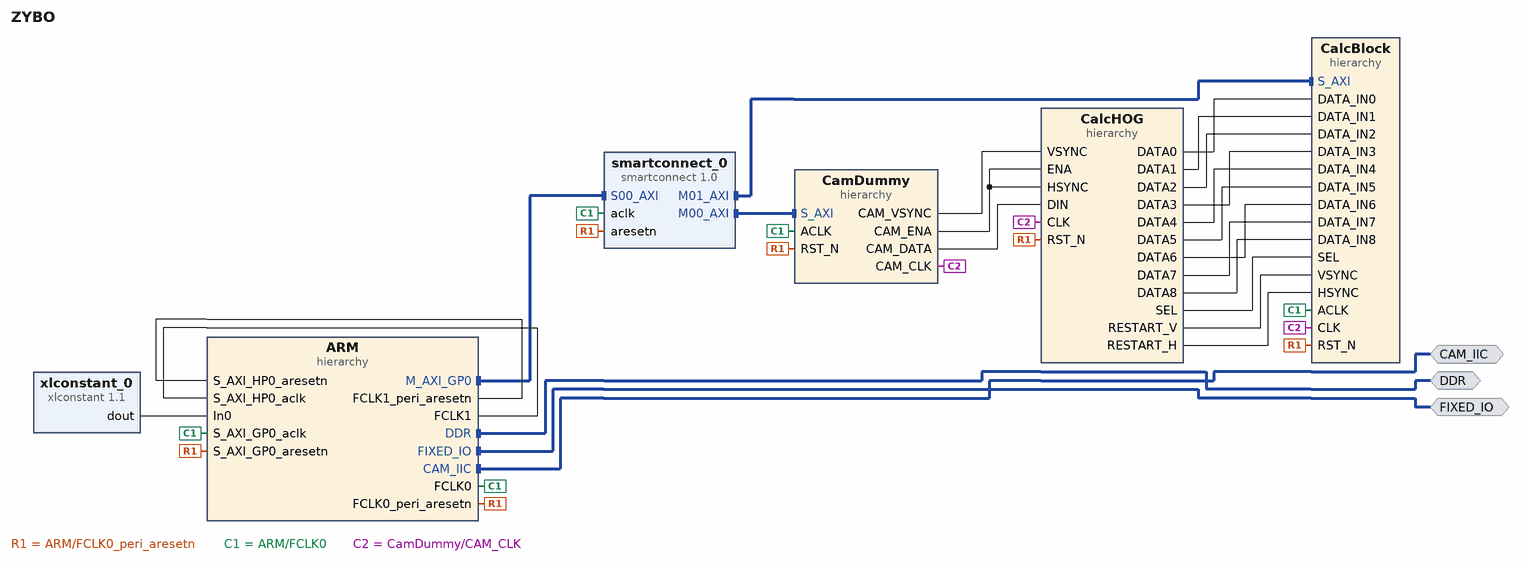
[diagram p0: block diagram of the top level]
# Vivado block design ZYBO, xc7z010clg400-1, Vivado 2016.3
create_bd_design ZYBO

create_bd_intf_port -mode Master -vlnv xilinx.com:interface:ddrx_rtl:1.0 DDR
create_bd_intf_port -mode Master -vlnv xilinx.com:display_processing_system7:fixedio_rtl:1.0 FIXED_IO
create_bd_intf_port -mode Master -vlnv xilinx.com:interface:iic_rtl:1.0 CAM_IIC

create_bd_cell -type hier ARM
create_bd_cell -type hier CalcBlock
create_bd_cell -type hier CalcHOG
create_bd_cell -type ip -vlnv xilinx.com:ip:smartconnect:1.0 smartconnect_0
set_property -dict {CONFIG.NUM_MI 2 CONFIG.NUM_SI 1 CONFIG.NUM_CLKS 1} [get_bd_cells smartconnect_0]
create_bd_cell -type hier CamDummy
create_bd_cell -type ip -vlnv xilinx.com:ip:xlconstant:1.1 xlconstant_0
set_property -dict {CONFIG.CONST_VAL 0} [get_bd_cells xlconstant_0]

# ---- hierarchy /ARM ----
current_bd_instance /ARM
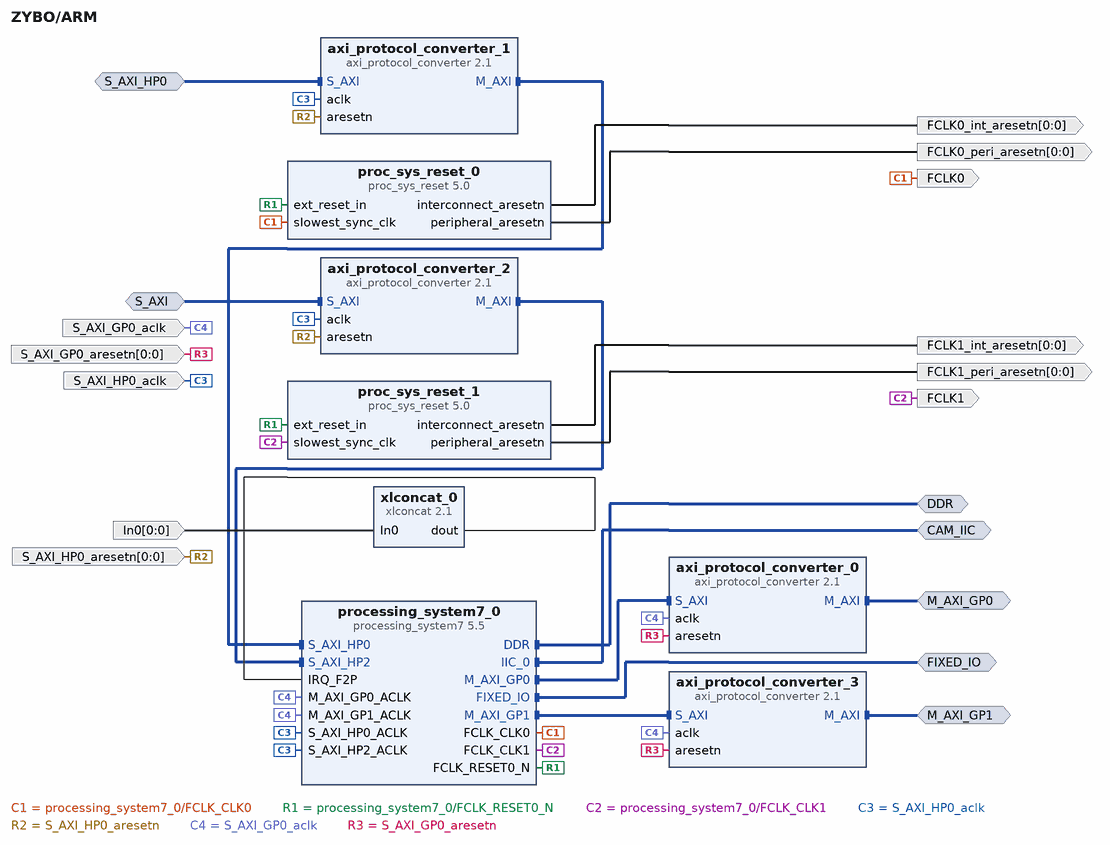
[diagram p1: block diagram inside /ARM]
create_bd_intf_pin -mode Master -vlnv xilinx.com:interface:ddrx_rtl:1.0 DDR
create_bd_intf_pin -mode Master -vlnv xilinx.com:display_processing_system7:fixedio_rtl:1.0 FIXED_IO
create_bd_intf_pin -mode Master -vlnv xilinx.com:interface:aximm_rtl:1.0 M_AXI_GP0
create_bd_intf_pin -mode Slave -vlnv xilinx.com:interface:aximm_rtl:1.0 S_AXI_HP0
create_bd_intf_pin -mode Master -vlnv xilinx.com:interface:iic_rtl:1.0 CAM_IIC
create_bd_intf_pin -mode Slave -vlnv xilinx.com:interface:aximm_rtl:1.0 S_AXI
create_bd_intf_pin -mode Master -vlnv xilinx.com:interface:aximm_rtl:1.0 M_AXI_GP1
create_bd_pin -dir O -type clk FCLK0
create_bd_pin -dir I -from 0 -to 0 In0
create_bd_pin -dir O -from 0 -to 0 -type rst FCLK0_int_aresetn
create_bd_pin -dir O -from 0 -to 0 -type rst FCLK0_peri_aresetn
create_bd_pin -dir O -type clk FCLK1
create_bd_pin -dir I -type clk S_AXI_HP0_aclk
create_bd_pin -dir I -from 0 -to 0 -type rst S_AXI_HP0_aresetn
create_bd_pin -dir I -type clk S_AXI_GP0_aclk
create_bd_pin -dir I -from 0 -to 0 -type rst S_AXI_GP0_aresetn
create_bd_pin -dir O -from 0 -to 0 -type rst FCLK1_int_aresetn
create_bd_pin -dir O -from 0 -to 0 -type rst FCLK1_peri_aresetn

create_bd_cell -type ip -vlnv xilinx.com:ip:xlconcat:2.1 xlconcat_0
set_property -dict {CONFIG.NUM_PORTS 1} [get_bd_cells xlconcat_0]
create_bd_cell -type ip -vlnv xilinx.com:ip:axi_protocol_converter:2.1 axi_protocol_converter_3
set_property -dict [list \
  CONFIG.SI_PROTOCOL AXI3 \
  CONFIG.MI_PROTOCOL AXI4LITE \
  CONFIG.TRANSLATION_MODE 2 \
] [get_bd_cells axi_protocol_converter_3]
create_bd_cell -type ip -vlnv xilinx.com:ip:axi_protocol_converter:2.1 axi_protocol_converter_0
set_property -dict [list \
  CONFIG.SI_PROTOCOL AXI3 \
  CONFIG.MI_PROTOCOL AXI4LITE \
  CONFIG.TRANSLATION_MODE 2 \
] [get_bd_cells axi_protocol_converter_0]
create_bd_cell -type ip -vlnv xilinx.com:ip:axi_protocol_converter:2.1 axi_protocol_converter_1
set_property -dict [list \
  CONFIG.SI_PROTOCOL AXI4 \
  CONFIG.MI_PROTOCOL AXI3 \
  CONFIG.TRANSLATION_MODE 2 \
  CONFIG.DATA_WIDTH 64 \
] [get_bd_cells axi_protocol_converter_1]
create_bd_cell -type ip -vlnv xilinx.com:ip:axi_protocol_converter:2.1 axi_protocol_converter_2
set_property -dict [list \
  CONFIG.SI_PROTOCOL AXI4 \
  CONFIG.MI_PROTOCOL AXI3 \
  CONFIG.TRANSLATION_MODE 2 \
  CONFIG.DATA_WIDTH 64 \
] [get_bd_cells axi_protocol_converter_2]
create_bd_cell -type ip -vlnv xilinx.com:ip:proc_sys_reset:5.0 proc_sys_reset_0
create_bd_cell -type ip -vlnv xilinx.com:ip:proc_sys_reset:5.0 proc_sys_reset_1
create_bd_cell -type ip -vlnv xilinx.com:ip:processing_system7:5.5 processing_system7_0
set_property -dict [list \
  CONFIG.PCW_FPGA0_PERIPHERAL_FREQMHZ 100 \
  CONFIG.PCW_FPGA1_PERIPHERAL_FREQMHZ 100 \
  CONFIG.PCW_USE_M_AXI_GP1 1 \
  CONFIG.PCW_USE_S_AXI_HP0 1 \
  CONFIG.PCW_USE_S_AXI_HP2 1 \
  CONFIG.PCW_USE_FABRIC_INTERRUPT 1 \
  CONFIG.PCW_EN_CLK1_PORT 1 \
  CONFIG.PCW_IRQ_F2P_INTR 1 \
  CONFIG.PCW_IMPORT_BOARD_PRESET /home/hidemi/workspace/ZYBO/ZYBO_zynq_def.xml \
  CONFIG.PCW_QSPI_GRP_SINGLE_SS_ENABLE 1 \
  CONFIG.PCW_SD0_GRP_WP_ENABLE 0 \
  CONFIG.PCW_USB0_RESET_ENABLE 1 \
  CONFIG.PCW_USB0_RESET_IO {MIO 46} \
  CONFIG.PCW_I2C0_PERIPHERAL_ENABLE 1 \
  CONFIG.PCW_GPIO_MIO_GPIO_ENABLE 1 \
  CONFIG.PCW_GPIO_MIO_GPIO_IO MIO \
  CONFIG.PCW_UIPARAM_GENERATE_SUMMARY NONE \
] [get_bd_cells processing_system7_0]
# 2 more settings of processing_system7_0 are not shown: defaults, MIO pin electricals, DDR timing, and values the tool derives

# ---- hierarchy /CalcBlock ----
current_bd_instance /CalcBlock
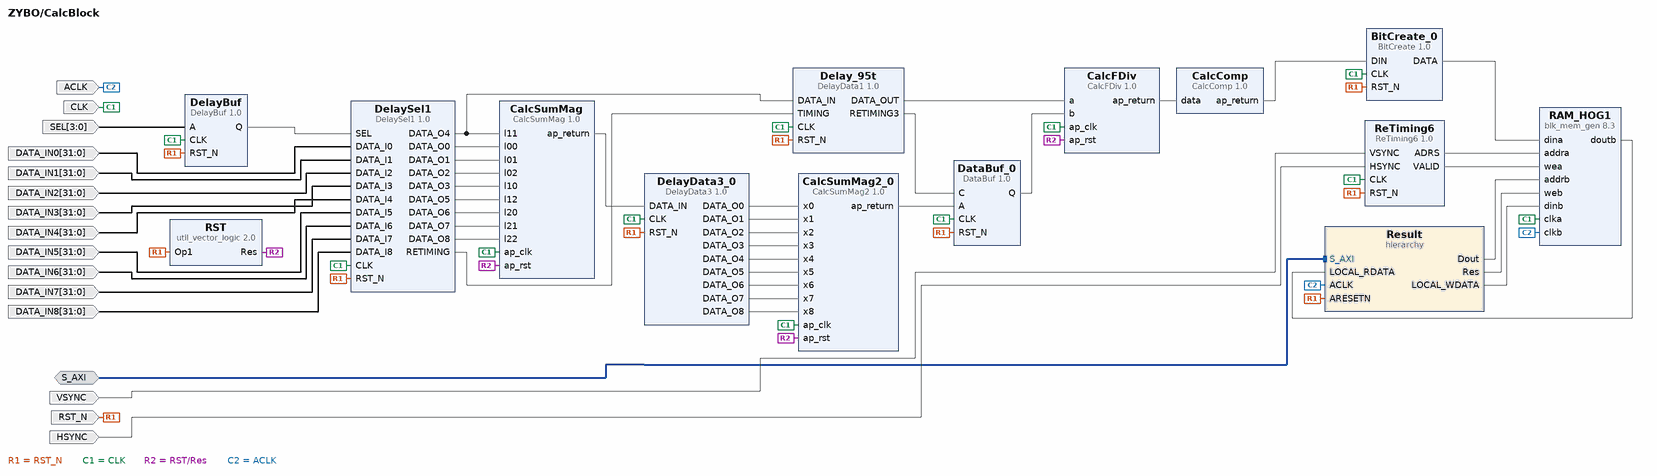
[diagram p2: block diagram inside /CalcBlock]
create_bd_intf_pin -mode Slave -vlnv xilinx.com:interface:aximm_rtl:1.0 S_AXI
create_bd_pin -dir I -type clk CLK
create_bd_pin -dir I -from 31 -to 0 DATA_IN0
create_bd_pin -dir I -from 31 -to 0 DATA_IN1
create_bd_pin -dir I -from 31 -to 0 DATA_IN2
create_bd_pin -dir I -from 31 -to 0 DATA_IN3
create_bd_pin -dir I -from 31 -to 0 DATA_IN4
create_bd_pin -dir I -from 31 -to 0 DATA_IN5
create_bd_pin -dir I -from 31 -to 0 DATA_IN6
create_bd_pin -dir I -from 31 -to 0 DATA_IN7
create_bd_pin -dir I -from 31 -to 0 DATA_IN8
create_bd_pin -dir I -from 3 -to 0 SEL
create_bd_pin -dir I VSYNC
create_bd_pin -dir I HSYNC
create_bd_pin -dir I -type clk ACLK
create_bd_pin -dir I RST_N

create_bd_cell -type ip -vlnv xilinx.com:ip:util_vector_logic:2.0 RST
set_property -dict {CONFIG.C_SIZE 1 CONFIG.C_OPERATION not} [get_bd_cells RST]
create_bd_cell -type hier Result
create_bd_cell -type ip -vlnv xilinx.com:ip:blk_mem_gen:8.3 RAM_HOG1
set_property -dict [list \
  CONFIG.Memory_Type True_Dual_Port_RAM \
  CONFIG.Enable_32bit_Address false \
  CONFIG.Use_Byte_Write_Enable false \
  CONFIG.Write_Width_A 9 \
  CONFIG.Read_Width_A 9 \
  CONFIG.Enable_A Always_Enabled \
  CONFIG.Write_Width_B 9 \
  CONFIG.Read_Width_B 9 \
  CONFIG.Enable_B Always_Enabled \
  CONFIG.Register_PortA_Output_of_Memory_Primitives false \
  CONFIG.Register_PortB_Output_of_Memory_Primitives false \
  CONFIG.Use_RSTA_Pin false \
  CONFIG.Port_B_Clock 100 \
  CONFIG.Port_B_Write_Rate 50 \
  CONFIG.Port_B_Enable_Rate 100 \
  CONFIG.use_bram_block Stand_Alone \
] [get_bd_cells RAM_HOG1]
create_bd_cell -type ip -vlnv user.org:user:CalcFDiv:1.0 CalcFDiv
create_bd_cell -type ip -vlnv user.org:user:DelayBuf:1.0 DelayBuf
create_bd_cell -type ip -vlnv user.org:user:BitCreate:1.0 BitCreate_0
create_bd_cell -type ip -vlnv user.org:user:CalcComp:1.0 CalcComp
create_bd_cell -type ip -vlnv user.org:user:ReTiming6:1.0 ReTiming6
create_bd_cell -type ip -vlnv user.org:user:CalcSumMag2:1.0 CalcSumMag2_0
create_bd_cell -type ip -vlnv user.org:user:DataBuf:1.0 DataBuf_0
create_bd_cell -type ip -vlnv user.org:user:CalcSumMag:1.0 CalcSumMag
create_bd_cell -type ip -vlnv user.org:user:DelaySel1:1.0 DelaySel1
create_bd_cell -type ip -vlnv user.org:user:DelayData3:1.0 DelayData3_0
create_bd_cell -type ip -vlnv user.org:user:DelayData1:1.0 Delay_95t

# ---- hierarchy /CalcBlock/Result ----
current_bd_instance /CalcBlock/Result
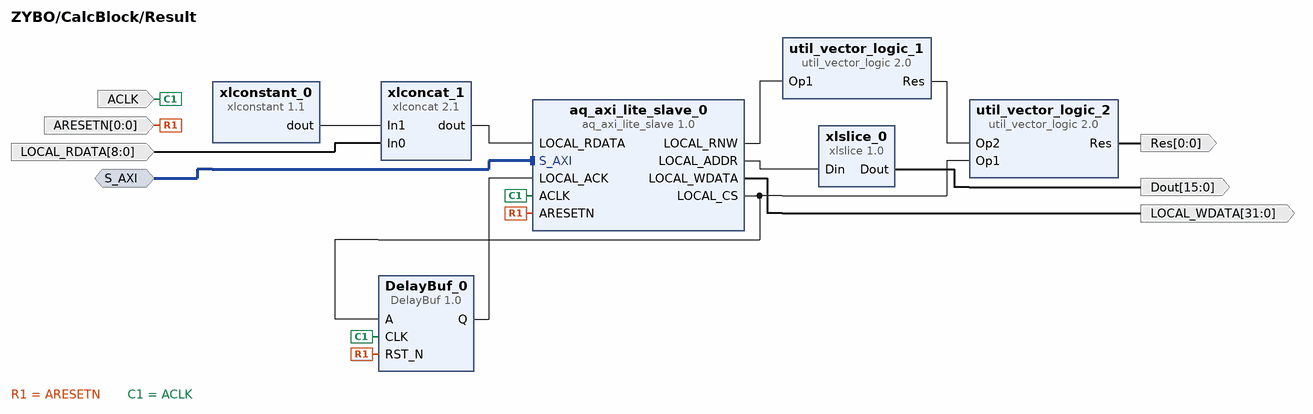
[diagram p3: block diagram inside /CalcBlock/Result]
create_bd_intf_pin -mode Slave -vlnv xilinx.com:interface:aximm_rtl:1.0 S_AXI
create_bd_pin -dir I -from 0 -to 0 -type rst ARESETN
create_bd_pin -dir I -type clk ACLK
create_bd_pin -dir O -from 15 -to 0 Dout
create_bd_pin -dir O -from 0 -to 0 Res
create_bd_pin -dir O -from 31 -to 0 LOCAL_WDATA
create_bd_pin -dir I -from 8 -to 0 LOCAL_RDATA

create_bd_cell -type ip -vlnv xilinx.com:ip:xlslice:1.0 xlslice_0
set_property -dict {CONFIG.DOUT_WIDTH 16 CONFIG.DIN_TO 2 CONFIG.DIN_FROM 17} [get_bd_cells xlslice_0]
create_bd_cell -type ip -vlnv xilinx.com:ip:util_vector_logic:2.0 util_vector_logic_1
set_property -dict {CONFIG.C_SIZE 1 CONFIG.C_OPERATION not} [get_bd_cells util_vector_logic_1]
create_bd_cell -type ip -vlnv xilinx.com:ip:util_vector_logic:2.0 util_vector_logic_2
set_property -dict {CONFIG.C_SIZE 1} [get_bd_cells util_vector_logic_2]
create_bd_cell -type ip -vlnv user.org:user:aq_axi_lite_slave:1.0 aq_axi_lite_slave_0
create_bd_cell -type ip -vlnv user.org:user:DelayBuf:1.0 DelayBuf_0
create_bd_cell -type ip -vlnv xilinx.com:ip:xlconstant:1.1 xlconstant_0
set_property -dict {CONFIG.CONST_WIDTH 23 CONFIG.CONST_VAL 0} [get_bd_cells xlconstant_0]
create_bd_cell -type ip -vlnv xilinx.com:ip:xlconcat:2.1 xlconcat_1
set_property -dict {CONFIG.IN0_WIDTH 9 CONFIG.IN1_WIDTH 23} [get_bd_cells xlconcat_1]

# ---- hierarchy /CalcHOG ----
current_bd_instance /CalcHOG
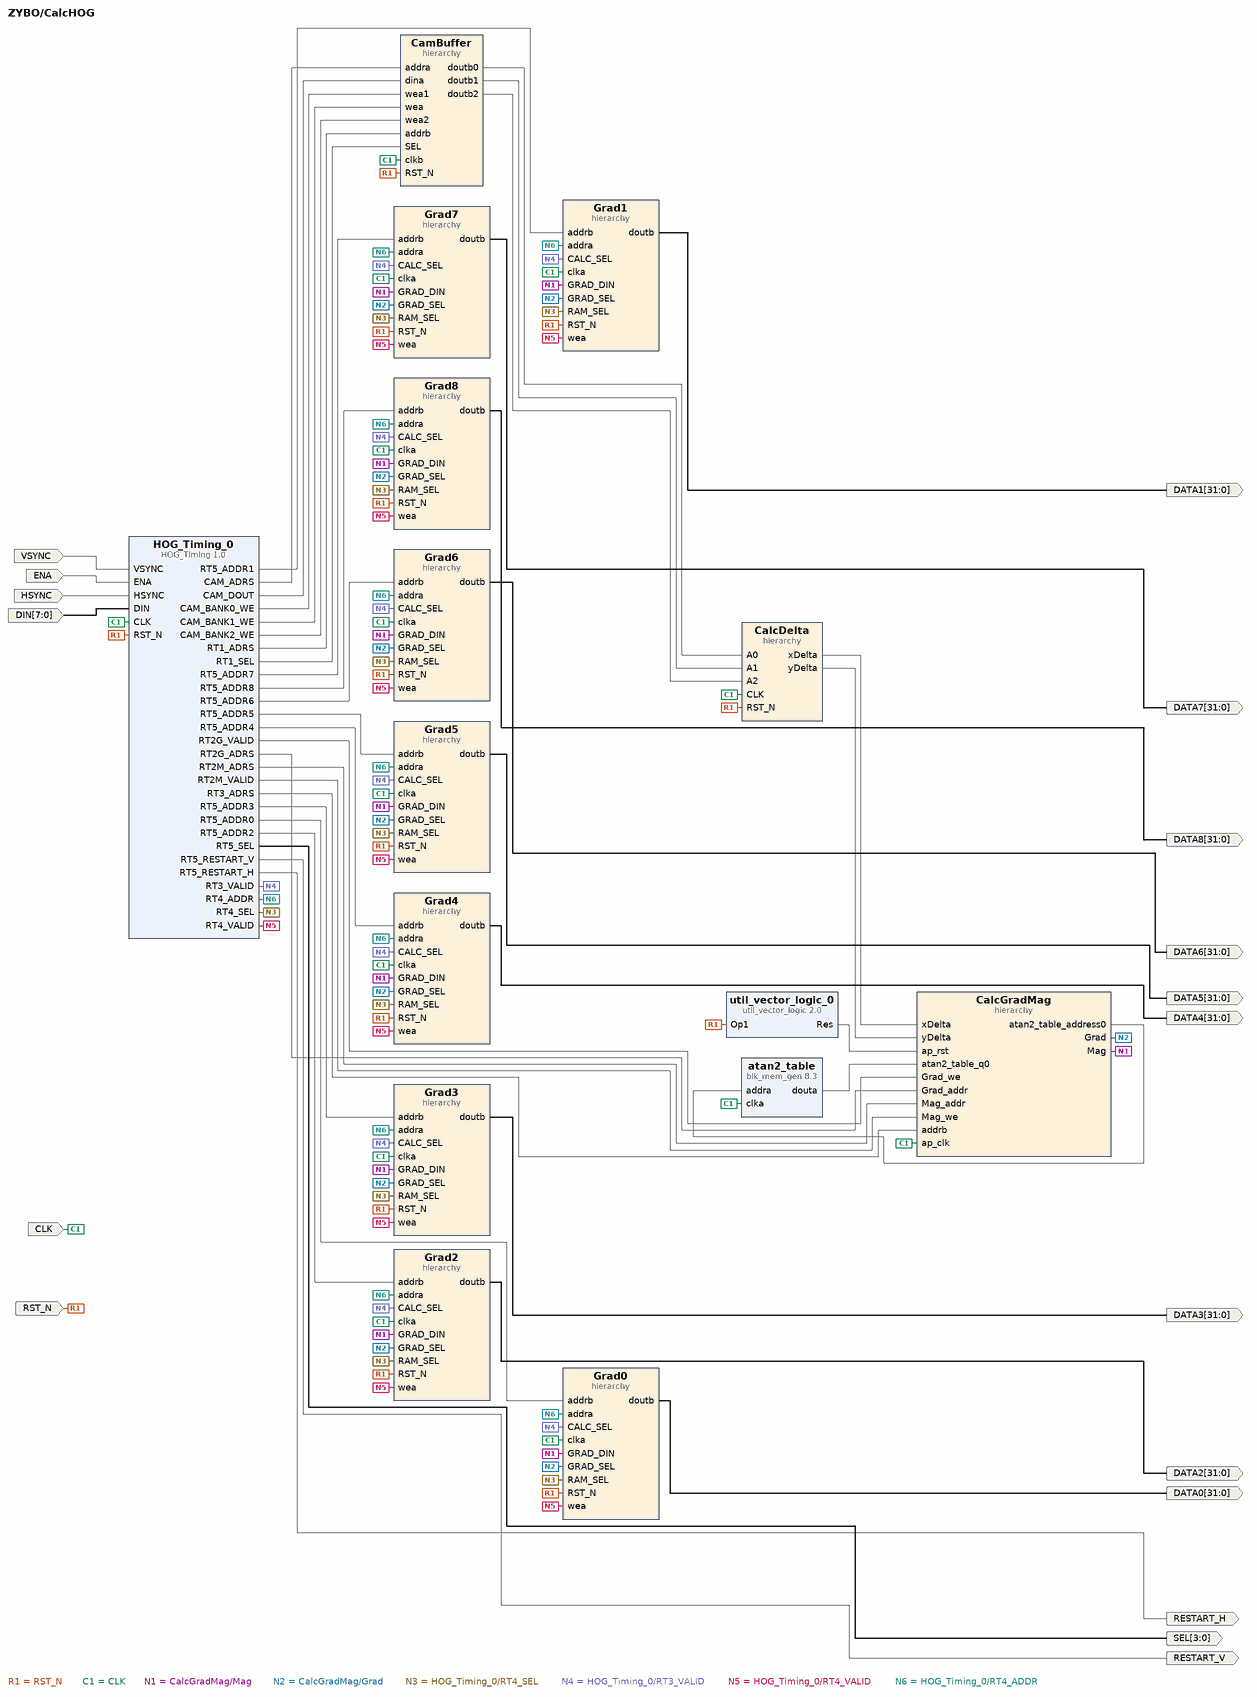
[diagram p4: block diagram inside /CalcHOG]
create_bd_pin -dir I -type clk CLK
create_bd_pin -dir I VSYNC
create_bd_pin -dir I ENA
create_bd_pin -dir I HSYNC
create_bd_pin -dir O -from 31 -to 0 DATA0
create_bd_pin -dir O -from 31 -to 0 DATA1
create_bd_pin -dir O -from 31 -to 0 DATA2
create_bd_pin -dir O -from 31 -to 0 DATA3
create_bd_pin -dir O -from 31 -to 0 DATA4
create_bd_pin -dir O -from 31 -to 0 DATA5
create_bd_pin -dir O -from 31 -to 0 DATA6
create_bd_pin -dir O -from 31 -to 0 DATA7
create_bd_pin -dir O -from 31 -to 0 DATA8
create_bd_pin -dir O -from 3 -to 0 SEL
create_bd_pin -dir I -from 7 -to 0 DIN
create_bd_pin -dir O RESTART_V
create_bd_pin -dir O RESTART_H
create_bd_pin -dir I RST_N

create_bd_cell -type ip -vlnv xilinx.com:ip:util_vector_logic:2.0 util_vector_logic_0
set_property -dict {CONFIG.C_SIZE 1 CONFIG.C_OPERATION not} [get_bd_cells util_vector_logic_0]
create_bd_cell -type ip -vlnv xilinx.com:ip:blk_mem_gen:8.3 atan2_table
set_property -dict [list \
  CONFIG.Memory_Type Single_Port_RAM \
  CONFIG.Enable_32bit_Address false \
  CONFIG.Use_Byte_Write_Enable false \
  CONFIG.Write_Width_A 4 \
  CONFIG.Read_Width_A 4 \
  CONFIG.Enable_A Always_Enabled \
  CONFIG.Register_PortA_Output_of_Memory_Primitives false \
  CONFIG.Load_Init_File true \
  CONFIG.Coe_File ../../../../../../../COE/atan2_table.coe \
  CONFIG.Use_RSTA_Pin false \
  CONFIG.Port_B_Clock 0 \
  CONFIG.Port_B_Write_Rate 0 \
  CONFIG.Port_B_Enable_Rate 0 \
  CONFIG.use_bram_block Stand_Alone \
] [get_bd_cells atan2_table]
create_bd_cell -type hier CamBuffer
create_bd_cell -type hier CalcDelta
create_bd_cell -type hier CalcGradMag
create_bd_cell -type hier Grad0
create_bd_cell -type hier Grad1
create_bd_cell -type hier Grad2
create_bd_cell -type hier Grad3
create_bd_cell -type hier Grad4
create_bd_cell -type hier Grad5
create_bd_cell -type hier Grad6
create_bd_cell -type hier Grad7
create_bd_cell -type hier Grad8
create_bd_cell -type ip -vlnv user.org:user:HOG_Timing:1.0 HOG_Timing_0

# ---- hierarchy /CalcHOG/CamBuffer ----
current_bd_instance /CalcHOG/CamBuffer
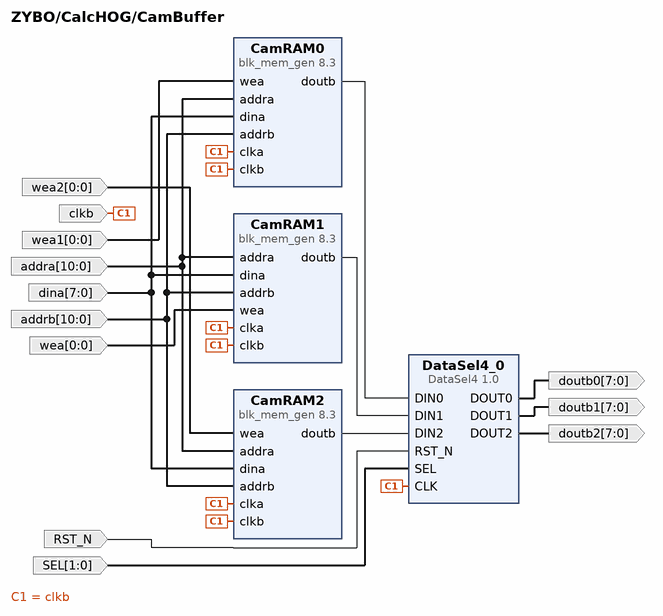
[diagram p5: block diagram inside /CalcHOG/CamBuffer]
create_bd_pin -dir I -type clk clkb
create_bd_pin -dir I -from 0 -to 0 wea
create_bd_pin -dir I -from 10 -to 0 addra
create_bd_pin -dir I -from 7 -to 0 dina
create_bd_pin -dir I -from 10 -to 0 addrb
create_bd_pin -dir O -from 7 -to 0 doutb1
create_bd_pin -dir I -from 0 -to 0 wea1
create_bd_pin -dir O -from 7 -to 0 doutb0
create_bd_pin -dir I -from 0 -to 0 wea2
create_bd_pin -dir O -from 7 -to 0 doutb2
create_bd_pin -dir I -type rst RST_N
create_bd_pin -dir I -from 1 -to 0 SEL

create_bd_cell -type ip -vlnv xilinx.com:ip:blk_mem_gen:8.3 CamRAM1
set_property -dict [list \
  CONFIG.Memory_Type True_Dual_Port_RAM \
  CONFIG.Enable_32bit_Address false \
  CONFIG.Use_Byte_Write_Enable false \
  CONFIG.Assume_Synchronous_Clk false \
  CONFIG.Write_Width_A 8 \
  CONFIG.Read_Width_A 8 \
  CONFIG.Enable_A Always_Enabled \
  CONFIG.Write_Width_B 8 \
  CONFIG.Read_Width_B 8 \
  CONFIG.Enable_B Always_Enabled \
  CONFIG.Register_PortA_Output_of_Memory_Primitives false \
  CONFIG.Register_PortB_Output_of_Memory_Primitives false \
  CONFIG.Use_RSTA_Pin false \
  CONFIG.Use_RSTB_Pin false \
  CONFIG.Port_B_Clock 100 \
  CONFIG.Port_B_Write_Rate 50 \
  CONFIG.Port_B_Enable_Rate 100 \
  CONFIG.Collision_Warnings NONE \
  CONFIG.Disable_Collision_Warnings true \
  CONFIG.Disable_Out_of_Range_Warnings true \
  CONFIG.use_bram_block Stand_Alone \
] [get_bd_cells CamRAM1]
create_bd_cell -type ip -vlnv xilinx.com:ip:blk_mem_gen:8.3 CamRAM0
set_property -dict [list \
  CONFIG.Memory_Type True_Dual_Port_RAM \
  CONFIG.Enable_32bit_Address false \
  CONFIG.Use_Byte_Write_Enable false \
  CONFIG.Assume_Synchronous_Clk false \
  CONFIG.Write_Width_A 8 \
  CONFIG.Read_Width_A 8 \
  CONFIG.Enable_A Always_Enabled \
  CONFIG.Write_Width_B 8 \
  CONFIG.Read_Width_B 8 \
  CONFIG.Enable_B Always_Enabled \
  CONFIG.Register_PortA_Output_of_Memory_Primitives false \
  CONFIG.Register_PortB_Output_of_Memory_Primitives false \
  CONFIG.Use_RSTA_Pin false \
  CONFIG.Use_RSTB_Pin false \
  CONFIG.Port_B_Clock 100 \
  CONFIG.Port_B_Write_Rate 50 \
  CONFIG.Port_B_Enable_Rate 100 \
  CONFIG.Collision_Warnings NONE \
  CONFIG.Disable_Collision_Warnings true \
  CONFIG.Disable_Out_of_Range_Warnings true \
  CONFIG.use_bram_block Stand_Alone \
] [get_bd_cells CamRAM0]
create_bd_cell -type ip -vlnv xilinx.com:ip:blk_mem_gen:8.3 CamRAM2
set_property -dict [list \
  CONFIG.Memory_Type True_Dual_Port_RAM \
  CONFIG.Enable_32bit_Address false \
  CONFIG.Use_Byte_Write_Enable false \
  CONFIG.Assume_Synchronous_Clk false \
  CONFIG.Write_Width_A 8 \
  CONFIG.Read_Width_A 8 \
  CONFIG.Enable_A Always_Enabled \
  CONFIG.Write_Width_B 8 \
  CONFIG.Read_Width_B 8 \
  CONFIG.Enable_B Always_Enabled \
  CONFIG.Register_PortA_Output_of_Memory_Primitives false \
  CONFIG.Register_PortB_Output_of_Memory_Primitives false \
  CONFIG.Use_RSTA_Pin false \
  CONFIG.Use_RSTB_Pin false \
  CONFIG.Port_B_Clock 100 \
  CONFIG.Port_B_Write_Rate 50 \
  CONFIG.Port_B_Enable_Rate 100 \
  CONFIG.Collision_Warnings NONE \
  CONFIG.Disable_Collision_Warnings true \
  CONFIG.Disable_Out_of_Range_Warnings true \
  CONFIG.use_bram_block Stand_Alone \
] [get_bd_cells CamRAM2]
create_bd_cell -type ip -vlnv user.org:user:DataSel4:1.0 DataSel4_0

# ---- hierarchy /CalcHOG/CalcDelta ----
current_bd_instance /CalcHOG/CalcDelta
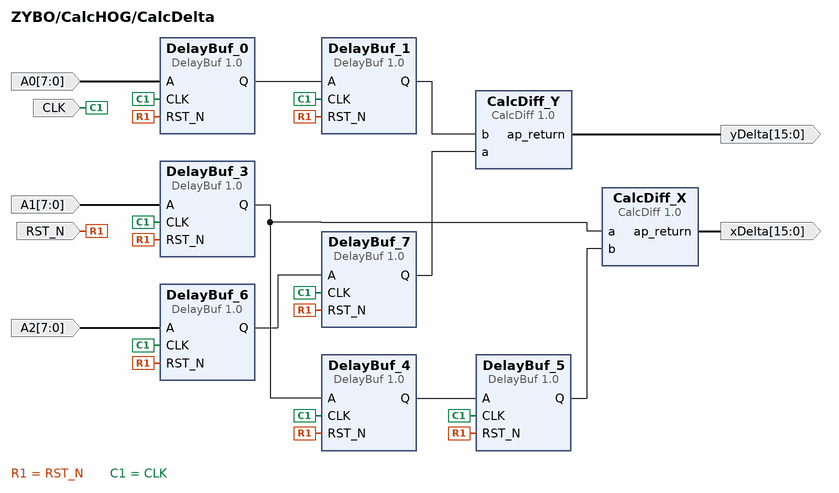
[diagram p6: block diagram inside /CalcHOG/CalcDelta]
create_bd_pin -dir I RST_N
create_bd_pin -dir I -type clk CLK
create_bd_pin -dir I -from 7 -to 0 A0
create_bd_pin -dir I -from 7 -to 0 A1
create_bd_pin -dir O -from 15 -to 0 yDelta
create_bd_pin -dir I -from 7 -to 0 A2
create_bd_pin -dir O -from 15 -to 0 xDelta

create_bd_cell -type ip -vlnv user.org:user:CalcDiff:1.0 CalcDiff_X
create_bd_cell -type ip -vlnv user.org:user:CalcDiff:1.0 CalcDiff_Y
create_bd_cell -type ip -vlnv user.org:user:DelayBuf:1.0 DelayBuf_0
create_bd_cell -type ip -vlnv user.org:user:DelayBuf:1.0 DelayBuf_3
create_bd_cell -type ip -vlnv user.org:user:DelayBuf:1.0 DelayBuf_6
create_bd_cell -type ip -vlnv user.org:user:DelayBuf:1.0 DelayBuf_1
create_bd_cell -type ip -vlnv user.org:user:DelayBuf:1.0 DelayBuf_4
create_bd_cell -type ip -vlnv user.org:user:DelayBuf:1.0 DelayBuf_7
create_bd_cell -type ip -vlnv user.org:user:DelayBuf:1.0 DelayBuf_5

# ---- hierarchy /CalcHOG/CalcGradMag ----
current_bd_instance /CalcHOG/CalcGradMag
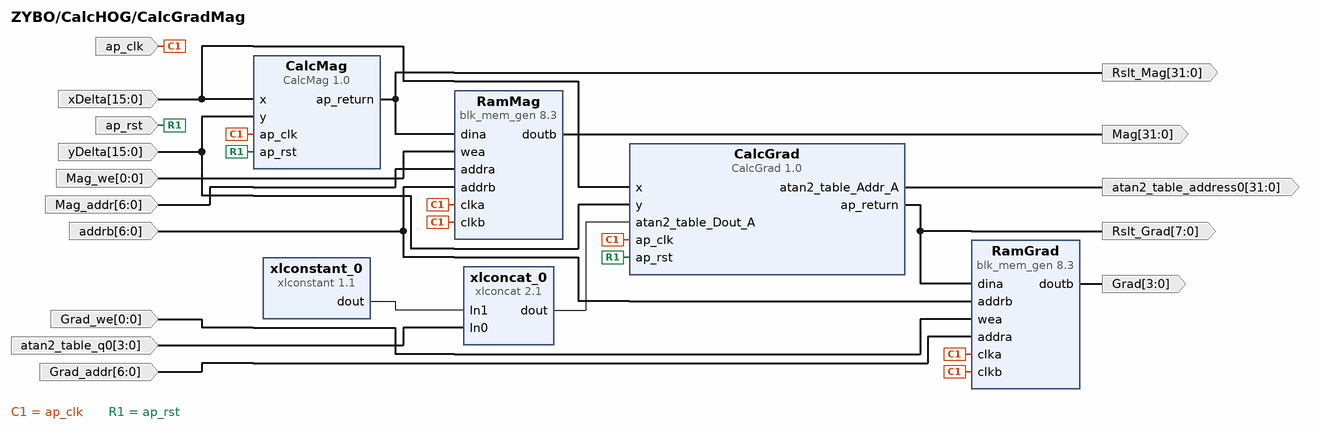
[diagram p7: block diagram inside /CalcHOG/CalcGradMag]
create_bd_pin -dir I -type clk ap_clk
create_bd_pin -dir O -from 31 -to 0 atan2_table_address0
create_bd_pin -dir I -from 3 -to 0 atan2_table_q0
create_bd_pin -dir I -from 15 -to 0 xDelta
create_bd_pin -dir I -from 15 -to 0 yDelta
create_bd_pin -dir I -from 0 -to 0 Grad_we
create_bd_pin -dir I -from 6 -to 0 Grad_addr
create_bd_pin -dir I -from 6 -to 0 addrb
create_bd_pin -dir O -from 3 -to 0 Grad
create_bd_pin -dir I -from 0 -to 0 Mag_we
create_bd_pin -dir I -from 6 -to 0 Mag_addr
create_bd_pin -dir O -from 31 -to 0 Mag
create_bd_pin -dir O -from 31 -to 0 Rslt_Mag
create_bd_pin -dir O -from 7 -to 0 Rslt_Grad
create_bd_pin -dir I ap_rst

create_bd_cell -type ip -vlnv xilinx.com:ip:blk_mem_gen:8.3 RamGrad
set_property -dict [list \
  CONFIG.Memory_Type True_Dual_Port_RAM \
  CONFIG.Enable_32bit_Address false \
  CONFIG.Use_Byte_Write_Enable false \
  CONFIG.Write_Width_A 4 \
  CONFIG.Read_Width_A 4 \
  CONFIG.Enable_A Always_Enabled \
  CONFIG.Write_Width_B 4 \
  CONFIG.Read_Width_B 4 \
  CONFIG.Enable_B Always_Enabled \
  CONFIG.Register_PortA_Output_of_Memory_Primitives false \
  CONFIG.Register_PortB_Output_of_Memory_Primitives false \
  CONFIG.Use_RSTA_Pin false \
  CONFIG.Port_B_Clock 100 \
  CONFIG.Port_B_Write_Rate 50 \
  CONFIG.Port_B_Enable_Rate 100 \
  CONFIG.Collision_Warnings NONE \
  CONFIG.Disable_Collision_Warnings true \
  CONFIG.Disable_Out_of_Range_Warnings true \
  CONFIG.use_bram_block Stand_Alone \
] [get_bd_cells RamGrad]
create_bd_cell -type ip -vlnv xilinx.com:ip:blk_mem_gen:8.3 RamMag
set_property -dict [list \
  CONFIG.Memory_Type True_Dual_Port_RAM \
  CONFIG.Enable_32bit_Address false \
  CONFIG.Use_Byte_Write_Enable false \
  CONFIG.Write_Width_A 32 \
  CONFIG.Read_Width_A 32 \
  CONFIG.Enable_A Always_Enabled \
  CONFIG.Write_Width_B 32 \
  CONFIG.Read_Width_B 32 \
  CONFIG.Enable_B Always_Enabled \
  CONFIG.Register_PortA_Output_of_Memory_Primitives false \
  CONFIG.Register_PortB_Output_of_Memory_Primitives false \
  CONFIG.Use_RSTA_Pin false \
  CONFIG.Port_B_Clock 100 \
  CONFIG.Port_B_Write_Rate 50 \
  CONFIG.Port_B_Enable_Rate 100 \
  CONFIG.Collision_Warnings NONE \
  CONFIG.Disable_Collision_Warnings true \
  CONFIG.Disable_Out_of_Range_Warnings true \
  CONFIG.use_bram_block Stand_Alone \
] [get_bd_cells RamMag]
create_bd_cell -type ip -vlnv user.org:user:CalcGrad:1.0 CalcGrad
create_bd_cell -type ip -vlnv user.org:user:CalcMag:1.0 CalcMag
create_bd_cell -type ip -vlnv xilinx.com:ip:xlconcat:2.1 xlconcat_0
set_property -dict {CONFIG.IN0_WIDTH 4 CONFIG.IN1_WIDTH 4} [get_bd_cells xlconcat_0]
create_bd_cell -type ip -vlnv xilinx.com:ip:xlconstant:1.1 xlconstant_0
set_property -dict {CONFIG.CONST_WIDTH 4 CONFIG.CONST_VAL 0} [get_bd_cells xlconstant_0]

# ---- hierarchy /CalcHOG/Grad0 ----
current_bd_instance /CalcHOG/Grad0
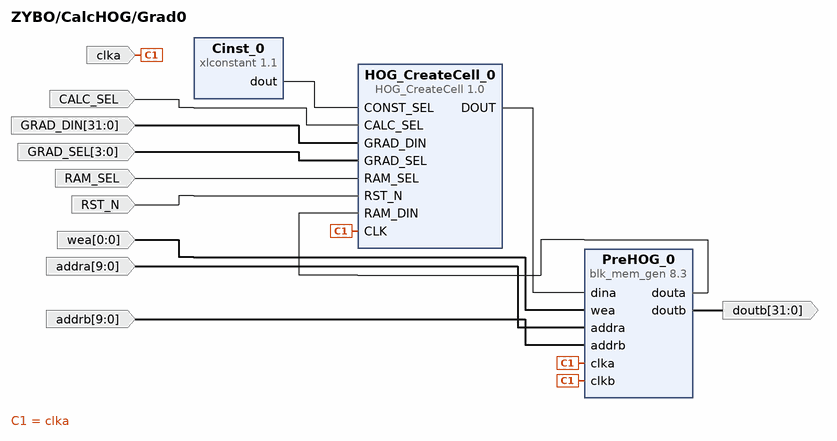
[diagram p8: block diagram inside /CalcHOG/Grad0]
create_bd_pin -dir I CALC_SEL
create_bd_pin -dir I -type clk clka
create_bd_pin -dir I -from 31 -to 0 GRAD_DIN
create_bd_pin -dir I -from 3 -to 0 GRAD_SEL
create_bd_pin -dir I RAM_SEL
create_bd_pin -dir I -from 0 -to 0 wea
create_bd_pin -dir I -from 9 -to 0 addra
create_bd_pin -dir I -from 9 -to 0 addrb
create_bd_pin -dir O -from 31 -to 0 doutb
create_bd_pin -dir I -type rst RST_N

create_bd_cell -type ip -vlnv xilinx.com:ip:xlconstant:1.1 Cinst_0
set_property -dict {CONFIG.CONST_WIDTH 4 CONFIG.CONST_VAL 0} [get_bd_cells Cinst_0]
create_bd_cell -type ip -vlnv xilinx.com:ip:blk_mem_gen:8.3 PreHOG_0
set_property -dict [list \
  CONFIG.Memory_Type True_Dual_Port_RAM \
  CONFIG.Enable_32bit_Address false \
  CONFIG.Use_Byte_Write_Enable false \
  CONFIG.Write_Width_A 32 \
  CONFIG.Read_Width_A 32 \
  CONFIG.Enable_A Always_Enabled \
  CONFIG.Write_Width_B 32 \
  CONFIG.Read_Width_B 32 \
  CONFIG.Enable_B Always_Enabled \
  CONFIG.Register_PortA_Output_of_Memory_Primitives false \
  CONFIG.Register_PortB_Output_of_Memory_Primitives false \
  CONFIG.Use_RSTA_Pin false \
  CONFIG.Port_B_Clock 100 \
  CONFIG.Port_B_Write_Rate 50 \
  CONFIG.Port_B_Enable_Rate 100 \
  CONFIG.use_bram_block Stand_Alone \
] [get_bd_cells PreHOG_0]
create_bd_cell -type ip -vlnv user.org:user:HOG_CreateCell:1.0 HOG_CreateCell_0

# ---- hierarchy /CalcHOG/Grad1 ----
current_bd_instance /CalcHOG/Grad1
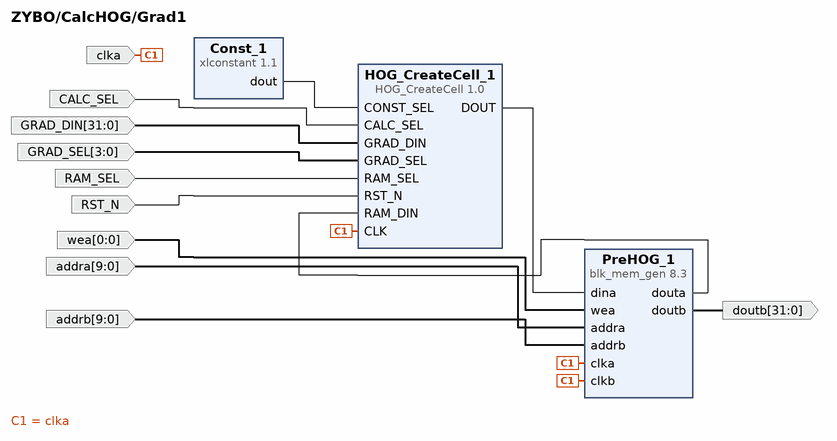
[diagram p9: block diagram inside /CalcHOG/Grad1]
create_bd_pin -dir I CALC_SEL
create_bd_pin -dir I -type clk clka
create_bd_pin -dir I -from 31 -to 0 GRAD_DIN
create_bd_pin -dir I -from 3 -to 0 GRAD_SEL
create_bd_pin -dir I RAM_SEL
create_bd_pin -dir I -from 0 -to 0 wea
create_bd_pin -dir I -from 9 -to 0 addra
create_bd_pin -dir I -from 9 -to 0 addrb
create_bd_pin -dir O -from 31 -to 0 doutb
create_bd_pin -dir I -type rst RST_N

create_bd_cell -type ip -vlnv xilinx.com:ip:xlconstant:1.1 Const_1
set_property -dict {CONFIG.CONST_WIDTH 4 CONFIG.CONST_VAL 1} [get_bd_cells Const_1]
create_bd_cell -type ip -vlnv xilinx.com:ip:blk_mem_gen:8.3 PreHOG_1
set_property -dict [list \
  CONFIG.Memory_Type True_Dual_Port_RAM \
  CONFIG.Enable_32bit_Address false \
  CONFIG.Use_Byte_Write_Enable false \
  CONFIG.Write_Width_A 32 \
  CONFIG.Read_Width_A 32 \
  CONFIG.Enable_A Always_Enabled \
  CONFIG.Write_Width_B 32 \
  CONFIG.Read_Width_B 32 \
  CONFIG.Enable_B Always_Enabled \
  CONFIG.Register_PortA_Output_of_Memory_Primitives false \
  CONFIG.Register_PortB_Output_of_Memory_Primitives false \
  CONFIG.Use_RSTA_Pin false \
  CONFIG.Port_B_Clock 100 \
  CONFIG.Port_B_Write_Rate 50 \
  CONFIG.Port_B_Enable_Rate 100 \
  CONFIG.use_bram_block Stand_Alone \
] [get_bd_cells PreHOG_1]
create_bd_cell -type ip -vlnv user.org:user:HOG_CreateCell:1.0 HOG_CreateCell_1

# ---- hierarchy /CalcHOG/Grad2 ----
current_bd_instance /CalcHOG/Grad2
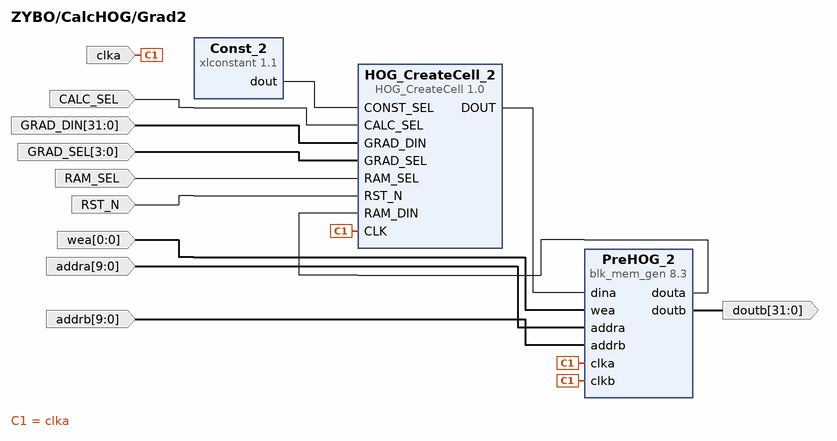
[diagram p10: block diagram inside /CalcHOG/Grad2]
create_bd_pin -dir I CALC_SEL
create_bd_pin -dir I -type clk clka
create_bd_pin -dir I -from 31 -to 0 GRAD_DIN
create_bd_pin -dir I -from 3 -to 0 GRAD_SEL
create_bd_pin -dir I RAM_SEL
create_bd_pin -dir I -from 0 -to 0 wea
create_bd_pin -dir I -from 9 -to 0 addra
create_bd_pin -dir I -from 9 -to 0 addrb
create_bd_pin -dir O -from 31 -to 0 doutb
create_bd_pin -dir I -type rst RST_N

create_bd_cell -type ip -vlnv xilinx.com:ip:xlconstant:1.1 Const_2
set_property -dict {CONFIG.CONST_WIDTH 4 CONFIG.CONST_VAL 2} [get_bd_cells Const_2]
create_bd_cell -type ip -vlnv xilinx.com:ip:blk_mem_gen:8.3 PreHOG_2
set_property -dict [list \
  CONFIG.Memory_Type True_Dual_Port_RAM \
  CONFIG.Enable_32bit_Address false \
  CONFIG.Use_Byte_Write_Enable false \
  CONFIG.Write_Width_A 32 \
  CONFIG.Read_Width_A 32 \
  CONFIG.Enable_A Always_Enabled \
  CONFIG.Write_Width_B 32 \
  CONFIG.Read_Width_B 32 \
  CONFIG.Enable_B Always_Enabled \
  CONFIG.Register_PortA_Output_of_Memory_Primitives false \
  CONFIG.Register_PortB_Output_of_Memory_Primitives false \
  CONFIG.Use_RSTA_Pin false \
  CONFIG.Port_B_Clock 100 \
  CONFIG.Port_B_Write_Rate 50 \
  CONFIG.Port_B_Enable_Rate 100 \
  CONFIG.use_bram_block Stand_Alone \
] [get_bd_cells PreHOG_2]
create_bd_cell -type ip -vlnv user.org:user:HOG_CreateCell:1.0 HOG_CreateCell_2

# ---- hierarchy /CalcHOG/Grad3 ----
current_bd_instance /CalcHOG/Grad3
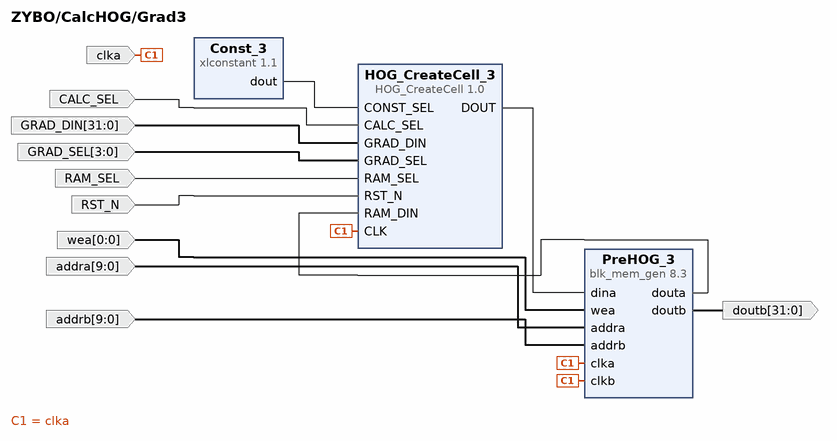
[diagram p11: block diagram inside /CalcHOG/Grad3]
create_bd_pin -dir I CALC_SEL
create_bd_pin -dir I -type clk clka
create_bd_pin -dir I -from 31 -to 0 GRAD_DIN
create_bd_pin -dir I -from 3 -to 0 GRAD_SEL
create_bd_pin -dir I RAM_SEL
create_bd_pin -dir I -from 0 -to 0 wea
create_bd_pin -dir I -from 9 -to 0 addra
create_bd_pin -dir I -from 9 -to 0 addrb
create_bd_pin -dir O -from 31 -to 0 doutb
create_bd_pin -dir I -type rst RST_N

create_bd_cell -type ip -vlnv xilinx.com:ip:xlconstant:1.1 Const_3
set_property -dict {CONFIG.CONST_WIDTH 4 CONFIG.CONST_VAL 3} [get_bd_cells Const_3]
create_bd_cell -type ip -vlnv xilinx.com:ip:blk_mem_gen:8.3 PreHOG_3
set_property -dict [list \
  CONFIG.Memory_Type True_Dual_Port_RAM \
  CONFIG.Enable_32bit_Address false \
  CONFIG.Use_Byte_Write_Enable false \
  CONFIG.Write_Width_A 32 \
  CONFIG.Read_Width_A 32 \
  CONFIG.Enable_A Always_Enabled \
  CONFIG.Write_Width_B 32 \
  CONFIG.Read_Width_B 32 \
  CONFIG.Enable_B Always_Enabled \
  CONFIG.Register_PortA_Output_of_Memory_Primitives false \
  CONFIG.Register_PortB_Output_of_Memory_Primitives false \
  CONFIG.Use_RSTA_Pin false \
  CONFIG.Port_B_Clock 100 \
  CONFIG.Port_B_Write_Rate 50 \
  CONFIG.Port_B_Enable_Rate 100 \
  CONFIG.use_bram_block Stand_Alone \
] [get_bd_cells PreHOG_3]
create_bd_cell -type ip -vlnv user.org:user:HOG_CreateCell:1.0 HOG_CreateCell_3

# ---- hierarchy /CalcHOG/Grad4 ----
current_bd_instance /CalcHOG/Grad4
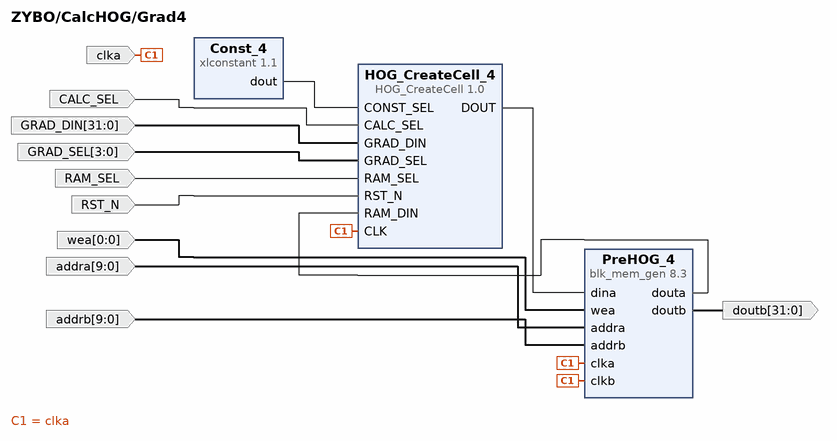
[diagram p12: block diagram inside /CalcHOG/Grad4]
create_bd_pin -dir I CALC_SEL
create_bd_pin -dir I -type clk clka
create_bd_pin -dir I -from 31 -to 0 GRAD_DIN
create_bd_pin -dir I -from 3 -to 0 GRAD_SEL
create_bd_pin -dir I RAM_SEL
create_bd_pin -dir I -from 0 -to 0 wea
create_bd_pin -dir I -from 9 -to 0 addra
create_bd_pin -dir I -from 9 -to 0 addrb
create_bd_pin -dir O -from 31 -to 0 doutb
create_bd_pin -dir I -type rst RST_N

create_bd_cell -type ip -vlnv xilinx.com:ip:xlconstant:1.1 Const_4
set_property -dict {CONFIG.CONST_WIDTH 4 CONFIG.CONST_VAL 4} [get_bd_cells Const_4]
create_bd_cell -type ip -vlnv xilinx.com:ip:blk_mem_gen:8.3 PreHOG_4
set_property -dict [list \
  CONFIG.Memory_Type True_Dual_Port_RAM \
  CONFIG.Enable_32bit_Address false \
  CONFIG.Use_Byte_Write_Enable false \
  CONFIG.Write_Width_A 32 \
  CONFIG.Read_Width_A 32 \
  CONFIG.Enable_A Always_Enabled \
  CONFIG.Write_Width_B 32 \
  CONFIG.Read_Width_B 32 \
  CONFIG.Enable_B Always_Enabled \
  CONFIG.Register_PortA_Output_of_Memory_Primitives false \
  CONFIG.Register_PortB_Output_of_Memory_Primitives true \
  CONFIG.Use_RSTA_Pin false \
  CONFIG.Port_B_Clock 100 \
  CONFIG.Port_B_Write_Rate 50 \
  CONFIG.Port_B_Enable_Rate 100 \
  CONFIG.use_bram_block Stand_Alone \
] [get_bd_cells PreHOG_4]
create_bd_cell -type ip -vlnv user.org:user:HOG_CreateCell:1.0 HOG_CreateCell_4

# ---- hierarchy /CalcHOG/Grad5 ----
current_bd_instance /CalcHOG/Grad5
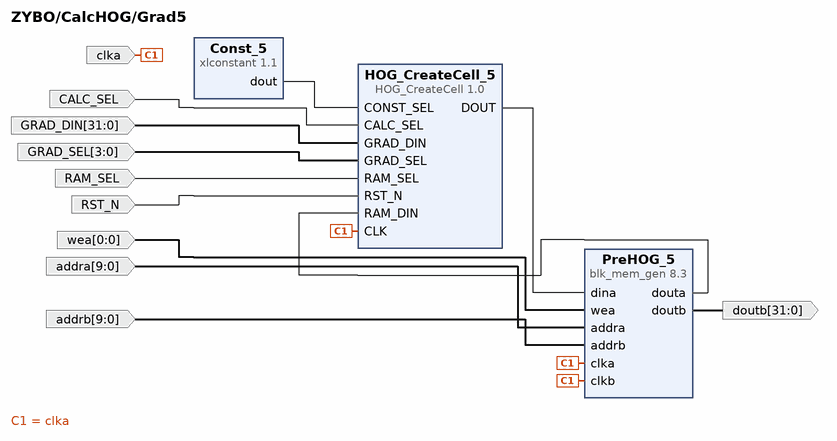
[diagram p13: block diagram inside /CalcHOG/Grad5]
create_bd_pin -dir I CALC_SEL
create_bd_pin -dir I -type clk clka
create_bd_pin -dir I -from 31 -to 0 GRAD_DIN
create_bd_pin -dir I -from 3 -to 0 GRAD_SEL
create_bd_pin -dir I RAM_SEL
create_bd_pin -dir I -from 0 -to 0 wea
create_bd_pin -dir I -from 9 -to 0 addra
create_bd_pin -dir I -from 9 -to 0 addrb
create_bd_pin -dir O -from 31 -to 0 doutb
create_bd_pin -dir I -type rst RST_N

create_bd_cell -type ip -vlnv xilinx.com:ip:xlconstant:1.1 Const_5
set_property -dict {CONFIG.CONST_WIDTH 4 CONFIG.CONST_VAL 5} [get_bd_cells Const_5]
create_bd_cell -type ip -vlnv xilinx.com:ip:blk_mem_gen:8.3 PreHOG_5
set_property -dict [list \
  CONFIG.Memory_Type True_Dual_Port_RAM \
  CONFIG.Enable_32bit_Address false \
  CONFIG.Use_Byte_Write_Enable false \
  CONFIG.Write_Width_A 32 \
  CONFIG.Read_Width_A 32 \
  CONFIG.Enable_A Always_Enabled \
  CONFIG.Write_Width_B 32 \
  CONFIG.Read_Width_B 32 \
  CONFIG.Enable_B Always_Enabled \
  CONFIG.Register_PortA_Output_of_Memory_Primitives false \
  CONFIG.Register_PortB_Output_of_Memory_Primitives false \
  CONFIG.Use_RSTA_Pin false \
  CONFIG.Port_B_Clock 100 \
  CONFIG.Port_B_Write_Rate 50 \
  CONFIG.Port_B_Enable_Rate 100 \
  CONFIG.use_bram_block Stand_Alone \
] [get_bd_cells PreHOG_5]
create_bd_cell -type ip -vlnv user.org:user:HOG_CreateCell:1.0 HOG_CreateCell_5

# ---- hierarchy /CalcHOG/Grad6 ----
current_bd_instance /CalcHOG/Grad6
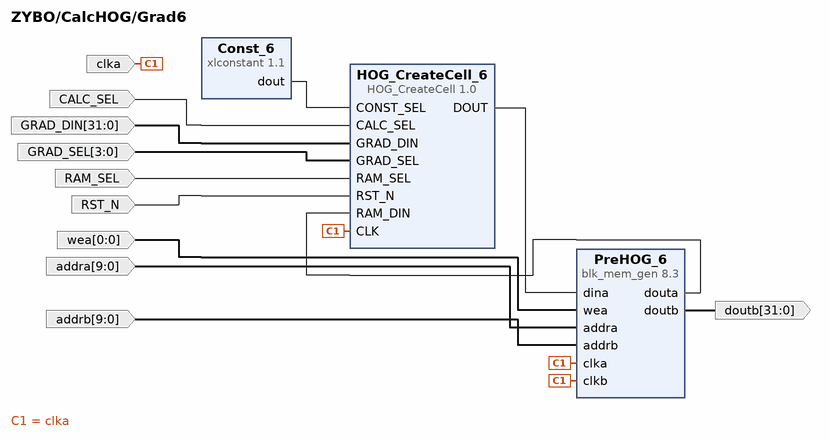
[diagram p14: block diagram inside /CalcHOG/Grad6]
create_bd_pin -dir I CALC_SEL
create_bd_pin -dir I -type clk clka
create_bd_pin -dir I -from 31 -to 0 GRAD_DIN
create_bd_pin -dir I -from 3 -to 0 GRAD_SEL
create_bd_pin -dir I RAM_SEL
create_bd_pin -dir I -type rst RST_N
create_bd_pin -dir I -from 0 -to 0 wea
create_bd_pin -dir I -from 9 -to 0 addra
create_bd_pin -dir I -from 9 -to 0 addrb
create_bd_pin -dir O -from 31 -to 0 doutb

create_bd_cell -type ip -vlnv xilinx.com:ip:xlconstant:1.1 Const_6
set_property -dict {CONFIG.CONST_WIDTH 4 CONFIG.CONST_VAL 6} [get_bd_cells Const_6]
create_bd_cell -type ip -vlnv xilinx.com:ip:blk_mem_gen:8.3 PreHOG_6
set_property -dict [list \
  CONFIG.Memory_Type True_Dual_Port_RAM \
  CONFIG.Enable_32bit_Address false \
  CONFIG.Use_Byte_Write_Enable false \
  CONFIG.Write_Width_A 32 \
  CONFIG.Read_Width_A 32 \
  CONFIG.Enable_A Always_Enabled \
  CONFIG.Write_Width_B 32 \
  CONFIG.Read_Width_B 32 \
  CONFIG.Enable_B Always_Enabled \
  CONFIG.Register_PortA_Output_of_Memory_Primitives false \
  CONFIG.Register_PortB_Output_of_Memory_Primitives false \
  CONFIG.Use_RSTA_Pin false \
  CONFIG.Port_B_Clock 100 \
  CONFIG.Port_B_Write_Rate 50 \
  CONFIG.Port_B_Enable_Rate 100 \
  CONFIG.use_bram_block Stand_Alone \
] [get_bd_cells PreHOG_6]
create_bd_cell -type ip -vlnv user.org:user:HOG_CreateCell:1.0 HOG_CreateCell_6

# ---- hierarchy /CalcHOG/Grad7 ----
current_bd_instance /CalcHOG/Grad7
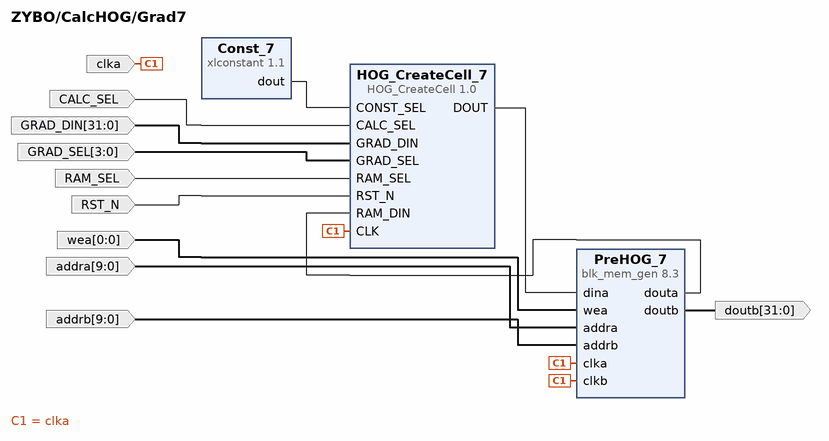
[diagram p15: block diagram inside /CalcHOG/Grad7]
create_bd_pin -dir I CALC_SEL
create_bd_pin -dir I -type clk clka
create_bd_pin -dir I -from 31 -to 0 GRAD_DIN
create_bd_pin -dir I -from 3 -to 0 GRAD_SEL
create_bd_pin -dir I RAM_SEL
create_bd_pin -dir I -type rst RST_N
create_bd_pin -dir I -from 0 -to 0 wea
create_bd_pin -dir I -from 9 -to 0 addra
create_bd_pin -dir I -from 9 -to 0 addrb
create_bd_pin -dir O -from 31 -to 0 doutb

create_bd_cell -type ip -vlnv xilinx.com:ip:xlconstant:1.1 Const_7
set_property -dict {CONFIG.CONST_WIDTH 4 CONFIG.CONST_VAL 7} [get_bd_cells Const_7]
create_bd_cell -type ip -vlnv xilinx.com:ip:blk_mem_gen:8.3 PreHOG_7
set_property -dict [list \
  CONFIG.Memory_Type True_Dual_Port_RAM \
  CONFIG.Enable_32bit_Address false \
  CONFIG.Use_Byte_Write_Enable false \
  CONFIG.Write_Width_A 32 \
  CONFIG.Read_Width_A 32 \
  CONFIG.Enable_A Always_Enabled \
  CONFIG.Write_Width_B 32 \
  CONFIG.Read_Width_B 32 \
  CONFIG.Enable_B Always_Enabled \
  CONFIG.Register_PortA_Output_of_Memory_Primitives false \
  CONFIG.Register_PortB_Output_of_Memory_Primitives false \
  CONFIG.Use_RSTA_Pin false \
  CONFIG.Port_B_Clock 100 \
  CONFIG.Port_B_Write_Rate 50 \
  CONFIG.Port_B_Enable_Rate 100 \
  CONFIG.use_bram_block Stand_Alone \
] [get_bd_cells PreHOG_7]
create_bd_cell -type ip -vlnv user.org:user:HOG_CreateCell:1.0 HOG_CreateCell_7

# ---- hierarchy /CalcHOG/Grad8 ----
current_bd_instance /CalcHOG/Grad8
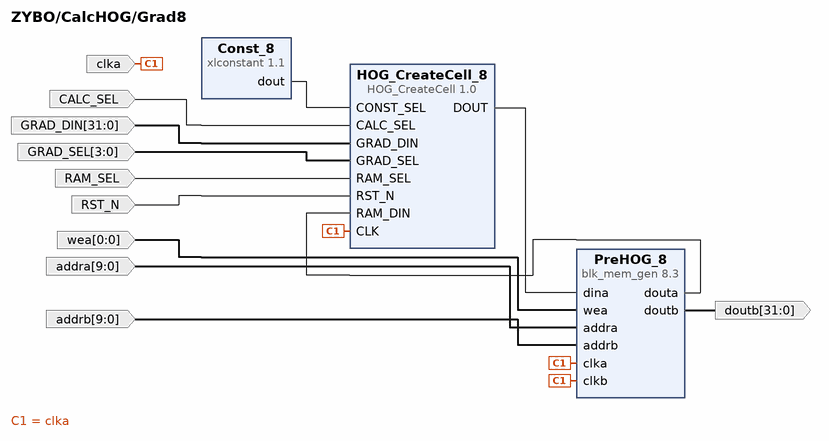
[diagram p16: block diagram inside /CalcHOG/Grad8]
create_bd_pin -dir I CALC_SEL
create_bd_pin -dir I -type clk clka
create_bd_pin -dir I -from 31 -to 0 GRAD_DIN
create_bd_pin -dir I -from 3 -to 0 GRAD_SEL
create_bd_pin -dir I RAM_SEL
create_bd_pin -dir I -type rst RST_N
create_bd_pin -dir I -from 0 -to 0 wea
create_bd_pin -dir I -from 9 -to 0 addra
create_bd_pin -dir I -from 9 -to 0 addrb
create_bd_pin -dir O -from 31 -to 0 doutb

create_bd_cell -type ip -vlnv xilinx.com:ip:xlconstant:1.1 Const_8
set_property -dict {CONFIG.CONST_WIDTH 4 CONFIG.CONST_VAL 8} [get_bd_cells Const_8]
create_bd_cell -type ip -vlnv xilinx.com:ip:blk_mem_gen:8.3 PreHOG_8
set_property -dict [list \
  CONFIG.Memory_Type True_Dual_Port_RAM \
  CONFIG.Enable_32bit_Address false \
  CONFIG.Use_Byte_Write_Enable false \
  CONFIG.Write_Width_A 32 \
  CONFIG.Read_Width_A 32 \
  CONFIG.Enable_A Always_Enabled \
  CONFIG.Write_Width_B 32 \
  CONFIG.Read_Width_B 32 \
  CONFIG.Enable_B Always_Enabled \
  CONFIG.Register_PortA_Output_of_Memory_Primitives false \
  CONFIG.Register_PortB_Output_of_Memory_Primitives true \
  CONFIG.Use_RSTA_Pin false \
  CONFIG.Port_B_Clock 100 \
  CONFIG.Port_B_Write_Rate 50 \
  CONFIG.Port_B_Enable_Rate 100 \
  CONFIG.use_bram_block Stand_Alone \
] [get_bd_cells PreHOG_8]
create_bd_cell -type ip -vlnv user.org:user:HOG_CreateCell:1.0 HOG_CreateCell_8

# ---- hierarchy /CamDummy ----
current_bd_instance /CamDummy
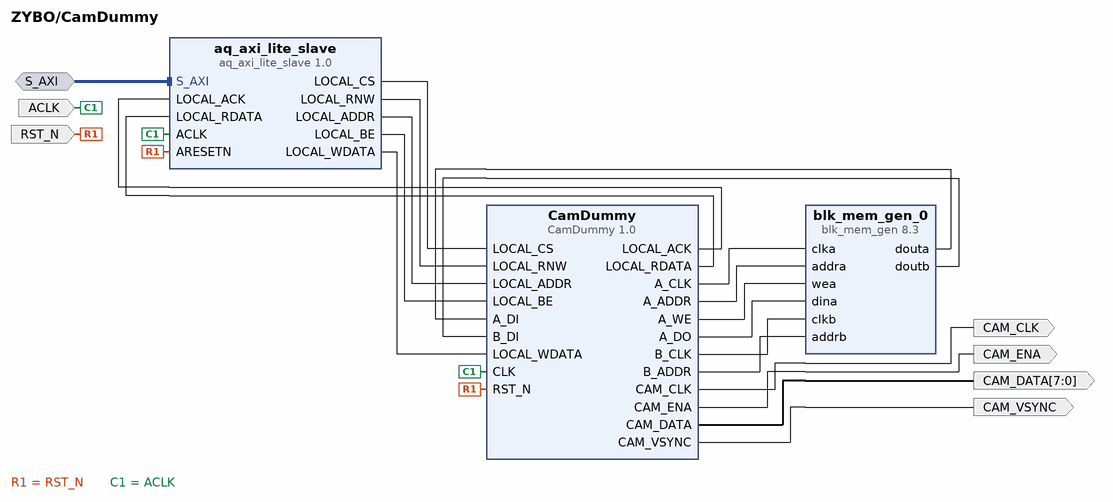
[diagram p17: block diagram inside /CamDummy]
create_bd_intf_pin -mode Slave -vlnv xilinx.com:interface:aximm_rtl:1.0 S_AXI
create_bd_pin -dir I -type rst RST_N
create_bd_pin -dir I -type clk ACLK
create_bd_pin -dir O -type clk CAM_CLK
create_bd_pin -dir O CAM_ENA
create_bd_pin -dir O CAM_VSYNC
create_bd_pin -dir O -from 7 -to 0 CAM_DATA

create_bd_cell -type ip -vlnv xilinx.com:ip:blk_mem_gen:8.3 blk_mem_gen_0
set_property -dict [list \
  CONFIG.Memory_Type True_Dual_Port_RAM \
  CONFIG.Enable_32bit_Address false \
  CONFIG.Use_Byte_Write_Enable false \
  CONFIG.Enable_A Always_Enabled \
  CONFIG.Write_Width_B 8 \
  CONFIG.Read_Width_B 8 \
  CONFIG.Enable_B Always_Enabled \
  CONFIG.Register_PortA_Output_of_Memory_Primitives false \
  CONFIG.Register_PortB_Output_of_Memory_Primitives false \
  CONFIG.Use_RSTA_Pin false \
  CONFIG.Use_RSTB_Pin false \
  CONFIG.Port_B_Clock 100 \
  CONFIG.Port_B_Write_Rate 50 \
  CONFIG.Port_B_Enable_Rate 100 \
  CONFIG.use_bram_block Stand_Alone \
] [get_bd_cells blk_mem_gen_0]
create_bd_cell -type ip -vlnv user.org:user:aq_axi_lite_slave:1.0 aq_axi_lite_slave
create_bd_cell -type ip -vlnv user.org:user:CamDummy:1.0 CamDummy

# ---- connections ----

current_bd_instance /ARM
connect_bd_intf_net [get_bd_intf_pins axi_protocol_converter_1/M_AXI] [get_bd_intf_pins processing_system7_0/S_AXI_HP0]
connect_bd_intf_net [get_bd_intf_pins processing_system7_0/M_AXI_GP0] [get_bd_intf_pins axi_protocol_converter_0/S_AXI]
connect_bd_intf_net [get_bd_intf_pins processing_system7_0/S_AXI_HP2] [get_bd_intf_pins axi_protocol_converter_2/M_AXI]
connect_bd_intf_net [get_bd_intf_pins processing_system7_0/M_AXI_GP1] [get_bd_intf_pins axi_protocol_converter_3/S_AXI]
connect_bd_intf_net [get_bd_intf_pins DDR] [get_bd_intf_pins processing_system7_0/DDR]
connect_bd_intf_net [get_bd_intf_pins FIXED_IO] [get_bd_intf_pins processing_system7_0/FIXED_IO]
connect_bd_intf_net [get_bd_intf_pins M_AXI_GP0] [get_bd_intf_pins axi_protocol_converter_0/M_AXI]
connect_bd_intf_net [get_bd_intf_pins S_AXI_HP0] [get_bd_intf_pins axi_protocol_converter_1/S_AXI]
connect_bd_intf_net [get_bd_intf_pins CAM_IIC] [get_bd_intf_pins processing_system7_0/IIC_0]
connect_bd_intf_net [get_bd_intf_pins S_AXI] [get_bd_intf_pins axi_protocol_converter_2/S_AXI]
connect_bd_intf_net [get_bd_intf_pins M_AXI_GP1] [get_bd_intf_pins axi_protocol_converter_3/M_AXI]
connect_bd_net -net axi_gpio_0_ip2intc_irpt [get_bd_pins In0] [get_bd_pins xlconcat_0/In0]
connect_bd_net [get_bd_pins proc_sys_reset_0/interconnect_aresetn] [get_bd_pins FCLK0_int_aresetn]
connect_bd_net [get_bd_pins processing_system7_0/FCLK_CLK0] [get_bd_pins FCLK0] [get_bd_pins proc_sys_reset_0/slowest_sync_clk]
connect_bd_net [get_bd_pins processing_system7_0/FCLK_RESET0_N] \
  [get_bd_pins proc_sys_reset_0/ext_reset_in] [get_bd_pins proc_sys_reset_1/ext_reset_in]
connect_bd_net [get_bd_pins xlconcat_0/dout] [get_bd_pins processing_system7_0/IRQ_F2P]
connect_bd_net [get_bd_pins processing_system7_0/FCLK_CLK1] [get_bd_pins FCLK1] [get_bd_pins proc_sys_reset_1/slowest_sync_clk]
connect_bd_net -net aclk_1 [get_bd_pins S_AXI_HP0_aclk] \
  [get_bd_pins axi_protocol_converter_1/aclk] [get_bd_pins axi_protocol_converter_2/aclk] \
  [get_bd_pins processing_system7_0/S_AXI_HP0_ACLK] [get_bd_pins processing_system7_0/S_AXI_HP2_ACLK]
connect_bd_net -net aresetn_1 [get_bd_pins S_AXI_HP0_aresetn] \
  [get_bd_pins axi_protocol_converter_1/aresetn] [get_bd_pins axi_protocol_converter_2/aresetn]
connect_bd_net -net aclk_2 [get_bd_pins S_AXI_GP0_aclk] \
  [get_bd_pins axi_protocol_converter_3/aclk] [get_bd_pins axi_protocol_converter_0/aclk] \
  [get_bd_pins processing_system7_0/M_AXI_GP0_ACLK] [get_bd_pins processing_system7_0/M_AXI_GP1_ACLK]
connect_bd_net -net aresetn_2 [get_bd_pins S_AXI_GP0_aresetn] \
  [get_bd_pins axi_protocol_converter_3/aresetn] [get_bd_pins axi_protocol_converter_0/aresetn]
connect_bd_net [get_bd_pins proc_sys_reset_0/peripheral_aresetn] [get_bd_pins FCLK0_peri_aresetn]
connect_bd_net [get_bd_pins proc_sys_reset_1/interconnect_aresetn] [get_bd_pins FCLK1_int_aresetn]
connect_bd_net [get_bd_pins proc_sys_reset_1/peripheral_aresetn] [get_bd_pins FCLK1_peri_aresetn]

current_bd_instance /CalcBlock
connect_bd_intf_net [get_bd_intf_pins S_AXI] [get_bd_intf_pins Result/S_AXI]
connect_bd_net [get_bd_pins RST_N] \
  [get_bd_pins RST/Op1] [get_bd_pins DelayBuf/RST_N] [get_bd_pins BitCreate_0/RST_N] [get_bd_pins ReTiming6/RST_N] \
  [get_bd_pins DelaySel1/RST_N] [get_bd_pins DelayData3_0/RST_N] [get_bd_pins DataBuf_0/RST_N] [get_bd_pins Delay_95t/RST_N] \
  [get_bd_pins Result/ARESETN]
connect_bd_net [get_bd_pins CLK] \
  [get_bd_pins RAM_HOG1/clka] [get_bd_pins CalcFDiv/ap_clk] [get_bd_pins DelayBuf/CLK] [get_bd_pins BitCreate_0/CLK] \
  [get_bd_pins ReTiming6/CLK] [get_bd_pins CalcSumMag2_0/ap_clk] [get_bd_pins DataBuf_0/CLK] [get_bd_pins CalcSumMag/ap_clk] \
  [get_bd_pins DelaySel1/CLK] [get_bd_pins DelayData3_0/CLK] [get_bd_pins Delay_95t/CLK]
connect_bd_net -net DelaySel1_0_DATA_O0 [get_bd_pins DelaySel1/DATA_O0] [get_bd_pins CalcSumMag/l00]
connect_bd_net -net DelaySel1_0_DATA_O1 [get_bd_pins DelaySel1/DATA_O1] [get_bd_pins CalcSumMag/l01]
connect_bd_net -net DelaySel1_0_DATA_O2 [get_bd_pins DelaySel1/DATA_O2] [get_bd_pins CalcSumMag/l02]
connect_bd_net -net DelaySel1_0_DATA_O3 [get_bd_pins DelaySel1/DATA_O3] [get_bd_pins CalcSumMag/l10]
connect_bd_net -net DelaySel1_0_DATA_O4 [get_bd_pins DelaySel1/DATA_O4] [get_bd_pins CalcSumMag/l11] [get_bd_pins Delay_95t/DATA_IN]
connect_bd_net -net DelaySel1_0_DATA_O5 [get_bd_pins DelaySel1/DATA_O5] [get_bd_pins CalcSumMag/l12]
connect_bd_net -net DelaySel1_0_DATA_O6 [get_bd_pins DelaySel1/DATA_O6] [get_bd_pins CalcSumMag/l20]
connect_bd_net -net DelaySel1_0_DATA_O7 [get_bd_pins DelaySel1/DATA_O7] [get_bd_pins CalcSumMag/l21]
connect_bd_net -net DelaySel1_0_DATA_O8 [get_bd_pins DelaySel1/DATA_O8] [get_bd_pins CalcSumMag/l22]
connect_bd_net -net DATA_IN0_1 [get_bd_pins DATA_IN0] [get_bd_pins DelaySel1/DATA_I0]
connect_bd_net -net DATA_IN1_1 [get_bd_pins DATA_IN1] [get_bd_pins DelaySel1/DATA_I1]
connect_bd_net -net DATA_IN2_1 [get_bd_pins DATA_IN2] [get_bd_pins DelaySel1/DATA_I2]
connect_bd_net -net DATA_IN3_1 [get_bd_pins DATA_IN3] [get_bd_pins DelaySel1/DATA_I3]
connect_bd_net -net DATA_IN4_1 [get_bd_pins DATA_IN4] [get_bd_pins DelaySel1/DATA_I4]
connect_bd_net -net DATA_IN5_1 [get_bd_pins DATA_IN5] [get_bd_pins DelaySel1/DATA_I5]
connect_bd_net -net DATA_IN6_1 [get_bd_pins DATA_IN6] [get_bd_pins DelaySel1/DATA_I6]
connect_bd_net -net DATA_IN7_1 [get_bd_pins DATA_IN7] [get_bd_pins DelaySel1/DATA_I7]
connect_bd_net -net DATA_IN8_1 [get_bd_pins DATA_IN8] [get_bd_pins DelaySel1/DATA_I8]
connect_bd_net -net CalcFDiv_0_ap_return [get_bd_pins CalcFDiv/ap_return] [get_bd_pins CalcComp/data]
connect_bd_net -net DelayData1_0_DATA_OUT [get_bd_pins Delay_95t/DATA_OUT] [get_bd_pins CalcFDiv/a]
connect_bd_net -net CalcComp_0_ap_return [get_bd_pins CalcComp/ap_return] [get_bd_pins BitCreate_0/DIN]
connect_bd_net [get_bd_pins BitCreate_0/DATA] [get_bd_pins RAM_HOG1/dina]
connect_bd_net -net util_vector_logic_0_Res [get_bd_pins RST/Res] \
  [get_bd_pins CalcFDiv/ap_rst] [get_bd_pins CalcSumMag2_0/ap_rst] [get_bd_pins CalcSumMag/ap_rst]
connect_bd_net -net ReTiming6_0_ADRS [get_bd_pins ReTiming6/ADRS] [get_bd_pins RAM_HOG1/addra]
connect_bd_net -net ReTiming6_0_VALID [get_bd_pins ReTiming6/VALID] [get_bd_pins RAM_HOG1/wea]
connect_bd_net [get_bd_pins VSYNC] [get_bd_pins ReTiming6/VSYNC]
connect_bd_net [get_bd_pins HSYNC] [get_bd_pins ReTiming6/HSYNC]
connect_bd_net [get_bd_pins SEL] [get_bd_pins DelayBuf/A]
connect_bd_net -net DelayBuf_0_Q [get_bd_pins DelayBuf/Q] [get_bd_pins DelaySel1/SEL]
connect_bd_net -net Debug_Dout [get_bd_pins Result/Dout] [get_bd_pins RAM_HOG1/addrb]
connect_bd_net -net Debug_Res [get_bd_pins Result/Res] [get_bd_pins RAM_HOG1/web]
connect_bd_net -net Debug_LOCAL_WDATA [get_bd_pins Result/LOCAL_WDATA] [get_bd_pins RAM_HOG1/dinb]
connect_bd_net [get_bd_pins ACLK] [get_bd_pins RAM_HOG1/clkb] [get_bd_pins Result/ACLK]
connect_bd_net [get_bd_pins RAM_HOG1/doutb] [get_bd_pins Result/LOCAL_RDATA]
connect_bd_net [get_bd_pins CalcSumMag/ap_return] [get_bd_pins DelayData3_0/DATA_IN]
connect_bd_net [get_bd_pins DelayData3_0/DATA_O0] [get_bd_pins CalcSumMag2_0/x0]
connect_bd_net [get_bd_pins DelayData3_0/DATA_O1] [get_bd_pins CalcSumMag2_0/x1]
connect_bd_net [get_bd_pins DelayData3_0/DATA_O2] [get_bd_pins CalcSumMag2_0/x2]
connect_bd_net [get_bd_pins DelayData3_0/DATA_O3] [get_bd_pins CalcSumMag2_0/x3]
connect_bd_net [get_bd_pins DelayData3_0/DATA_O4] [get_bd_pins CalcSumMag2_0/x4]
connect_bd_net [get_bd_pins DelayData3_0/DATA_O5] [get_bd_pins CalcSumMag2_0/x5]
connect_bd_net [get_bd_pins DelayData3_0/DATA_O6] [get_bd_pins CalcSumMag2_0/x6]
connect_bd_net [get_bd_pins DelayData3_0/DATA_O7] [get_bd_pins CalcSumMag2_0/x7]
connect_bd_net [get_bd_pins DelayData3_0/DATA_O8] [get_bd_pins CalcSumMag2_0/x8]
connect_bd_net [get_bd_pins CalcSumMag2_0/ap_return] [get_bd_pins DataBuf_0/A]
connect_bd_net [get_bd_pins DataBuf_0/Q] [get_bd_pins CalcFDiv/b]
connect_bd_net [get_bd_pins DelaySel1/RETIMING] [get_bd_pins Delay_95t/TIMING]
connect_bd_net -net Delay_55t_RETIMING3 [get_bd_pins Delay_95t/RETIMING3] [get_bd_pins DataBuf_0/C]

current_bd_instance /CalcBlock/Result
connect_bd_intf_net [get_bd_intf_pins S_AXI] [get_bd_intf_pins aq_axi_lite_slave_0/S_AXI]
connect_bd_net [get_bd_pins aq_axi_lite_slave_0/LOCAL_CS] [get_bd_pins util_vector_logic_2/Op1] [get_bd_pins DelayBuf_0/A]
connect_bd_net [get_bd_pins aq_axi_lite_slave_0/LOCAL_RNW] [get_bd_pins util_vector_logic_1/Op1]
connect_bd_net [get_bd_pins aq_axi_lite_slave_0/LOCAL_ADDR] [get_bd_pins xlslice_0/Din]
connect_bd_net [get_bd_pins util_vector_logic_1/Res] [get_bd_pins util_vector_logic_2/Op2]
connect_bd_net [get_bd_pins ARESETN] [get_bd_pins aq_axi_lite_slave_0/ARESETN] [get_bd_pins DelayBuf_0/RST_N]
connect_bd_net [get_bd_pins ACLK] [get_bd_pins aq_axi_lite_slave_0/ACLK] [get_bd_pins DelayBuf_0/CLK]
connect_bd_net [get_bd_pins xlslice_0/Dout] [get_bd_pins Dout]
connect_bd_net [get_bd_pins util_vector_logic_2/Res] [get_bd_pins Res]
connect_bd_net [get_bd_pins aq_axi_lite_slave_0/LOCAL_WDATA] [get_bd_pins LOCAL_WDATA]
connect_bd_net [get_bd_pins DelayBuf_0/Q] [get_bd_pins aq_axi_lite_slave_0/LOCAL_ACK]
connect_bd_net [get_bd_pins xlconstant_0/dout] [get_bd_pins xlconcat_1/In1]
connect_bd_net [get_bd_pins LOCAL_RDATA] [get_bd_pins xlconcat_1/In0]
connect_bd_net [get_bd_pins xlconcat_1/dout] [get_bd_pins aq_axi_lite_slave_0/LOCAL_RDATA]

current_bd_instance /CalcHOG
connect_bd_net [get_bd_pins VSYNC] [get_bd_pins HOG_Timing_0/VSYNC]
connect_bd_net [get_bd_pins ENA] [get_bd_pins HOG_Timing_0/ENA]
connect_bd_net [get_bd_pins HSYNC] [get_bd_pins HOG_Timing_0/HSYNC]
connect_bd_net [get_bd_pins RST_N] \
  [get_bd_pins util_vector_logic_0/Op1] [get_bd_pins CalcDelta/RST_N] [get_bd_pins Grad6/RST_N] [get_bd_pins Grad7/RST_N] \
  [get_bd_pins Grad8/RST_N] [get_bd_pins CamBuffer/RST_N] [get_bd_pins Grad5/RST_N] [get_bd_pins Grad4/RST_N] \
  [get_bd_pins Grad3/RST_N] [get_bd_pins Grad2/RST_N] [get_bd_pins Grad1/RST_N] [get_bd_pins Grad0/RST_N] \
  [get_bd_pins HOG_Timing_0/RST_N]
connect_bd_net -net CamRAM_doutb [get_bd_pins CamBuffer/doutb0] [get_bd_pins CalcDelta/A0]
connect_bd_net -net CamRAM1_doutb [get_bd_pins CamBuffer/doutb1] [get_bd_pins CalcDelta/A1]
connect_bd_net -net CamRAM2_doutb [get_bd_pins CamBuffer/doutb2] [get_bd_pins CalcDelta/A2]
connect_bd_net -net CalcDiff_0_ap_return [get_bd_pins CalcDelta/xDelta] [get_bd_pins CalcGradMag/xDelta]
connect_bd_net -net CalcDiff_1_ap_return [get_bd_pins CalcDelta/yDelta] [get_bd_pins CalcGradMag/yDelta]
connect_bd_net [get_bd_pins CLK] \
  [get_bd_pins atan2_table/clka] [get_bd_pins CamBuffer/clkb] [get_bd_pins CalcDelta/CLK] [get_bd_pins CalcGradMag/ap_clk] \
  [get_bd_pins Grad0/clka] [get_bd_pins Grad1/clka] [get_bd_pins Grad2/clka] [get_bd_pins Grad3/clka] \
  [get_bd_pins Grad4/clka] [get_bd_pins Grad5/clka] [get_bd_pins Grad6/clka] [get_bd_pins Grad7/clka] \
  [get_bd_pins Grad8/clka] [get_bd_pins HOG_Timing_0/CLK]
connect_bd_net -net PreHOG_doutb [get_bd_pins Grad0/doutb] [get_bd_pins DATA0]
connect_bd_net -net PreHOG1_doutb [get_bd_pins Grad1/doutb] [get_bd_pins DATA1]
connect_bd_net -net PreHOG2_doutb [get_bd_pins Grad2/doutb] [get_bd_pins DATA2]
connect_bd_net -net PreHOG3_doutb [get_bd_pins Grad3/doutb] [get_bd_pins DATA3]
connect_bd_net -net PreHOG4_doutb [get_bd_pins Grad4/doutb] [get_bd_pins DATA4]
connect_bd_net -net PreHOG5_doutb [get_bd_pins Grad5/doutb] [get_bd_pins DATA5]
connect_bd_net -net PreHOG7_doutb [get_bd_pins Grad7/doutb] [get_bd_pins DATA7]
connect_bd_net -net PreHOG6_doutb [get_bd_pins Grad6/doutb] [get_bd_pins DATA6]
connect_bd_net [get_bd_pins DIN] [get_bd_pins HOG_Timing_0/DIN]
connect_bd_net -net ReTiming5_0_SELECT [get_bd_pins HOG_Timing_0/RT5_SEL] [get_bd_pins SEL]
connect_bd_net -net RamMag_doutb [get_bd_pins CalcGradMag/Mag] \
  [get_bd_pins Grad0/GRAD_DIN] [get_bd_pins Grad1/GRAD_DIN] [get_bd_pins Grad2/GRAD_DIN] [get_bd_pins Grad3/GRAD_DIN] \
  [get_bd_pins Grad4/GRAD_DIN] [get_bd_pins Grad5/GRAD_DIN] [get_bd_pins Grad6/GRAD_DIN] [get_bd_pins Grad7/GRAD_DIN] \
  [get_bd_pins Grad8/GRAD_DIN]
connect_bd_net -net RamGrad_doutb [get_bd_pins CalcGradMag/Grad] \
  [get_bd_pins Grad0/GRAD_SEL] [get_bd_pins Grad1/GRAD_SEL] [get_bd_pins Grad2/GRAD_SEL] [get_bd_pins Grad3/GRAD_SEL] \
  [get_bd_pins Grad4/GRAD_SEL] [get_bd_pins Grad5/GRAD_SEL] [get_bd_pins Grad6/GRAD_SEL] [get_bd_pins Grad7/GRAD_SEL] \
  [get_bd_pins Grad8/GRAD_SEL]
connect_bd_net -net ReTiming4_0_SEL [get_bd_pins HOG_Timing_0/RT4_SEL] \
  [get_bd_pins Grad0/RAM_SEL] [get_bd_pins Grad1/RAM_SEL] [get_bd_pins Grad2/RAM_SEL] [get_bd_pins Grad3/RAM_SEL] \
  [get_bd_pins Grad4/RAM_SEL] [get_bd_pins Grad5/RAM_SEL] [get_bd_pins Grad6/RAM_SEL] [get_bd_pins Grad7/RAM_SEL] \
  [get_bd_pins Grad8/RAM_SEL]
connect_bd_net -net ReTiming3_0_VALID [get_bd_pins HOG_Timing_0/RT3_VALID] \
  [get_bd_pins Grad0/CALC_SEL] [get_bd_pins Grad1/CALC_SEL] [get_bd_pins Grad2/CALC_SEL] [get_bd_pins Grad3/CALC_SEL] \
  [get_bd_pins Grad4/CALC_SEL] [get_bd_pins Grad5/CALC_SEL] [get_bd_pins Grad6/CALC_SEL] [get_bd_pins Grad7/CALC_SEL] \
  [get_bd_pins Grad8/CALC_SEL]
connect_bd_net -net PreHOG8_doutb [get_bd_pins Grad8/doutb] [get_bd_pins DATA8]
connect_bd_net [get_bd_pins HOG_Timing_0/CAM_ADRS] [get_bd_pins CamBuffer/addra]
connect_bd_net [get_bd_pins HOG_Timing_0/CAM_DOUT] [get_bd_pins CamBuffer/dina]
connect_bd_net [get_bd_pins HOG_Timing_0/CAM_BANK0_WE] [get_bd_pins CamBuffer/wea1]
connect_bd_net [get_bd_pins HOG_Timing_0/CAM_BANK1_WE] [get_bd_pins CamBuffer/wea]
connect_bd_net [get_bd_pins HOG_Timing_0/CAM_BANK2_WE] [get_bd_pins CamBuffer/wea2]
connect_bd_net [get_bd_pins HOG_Timing_0/RT1_ADRS] [get_bd_pins CamBuffer/addrb]
connect_bd_net [get_bd_pins HOG_Timing_0/RT2G_VALID] [get_bd_pins CalcGradMag/Grad_we]
connect_bd_net [get_bd_pins HOG_Timing_0/RT2G_ADRS] [get_bd_pins CalcGradMag/Grad_addr]
connect_bd_net [get_bd_pins HOG_Timing_0/RT2M_ADRS] [get_bd_pins CalcGradMag/Mag_addr]
connect_bd_net [get_bd_pins HOG_Timing_0/RT2M_VALID] [get_bd_pins CalcGradMag/Mag_we]
connect_bd_net [get_bd_pins HOG_Timing_0/RT3_ADRS] [get_bd_pins CalcGradMag/addrb]
connect_bd_net [get_bd_pins HOG_Timing_0/RT4_VALID] \
  [get_bd_pins Grad0/wea] [get_bd_pins Grad1/wea] [get_bd_pins Grad2/wea] [get_bd_pins Grad3/wea] [get_bd_pins Grad4/wea] \
  [get_bd_pins Grad5/wea] [get_bd_pins Grad6/wea] [get_bd_pins Grad7/wea] [get_bd_pins Grad8/wea]
connect_bd_net [get_bd_pins HOG_Timing_0/RT4_ADDR] \
  [get_bd_pins Grad0/addra] [get_bd_pins Grad1/addra] [get_bd_pins Grad2/addra] [get_bd_pins Grad3/addra] \
  [get_bd_pins Grad4/addra] [get_bd_pins Grad5/addra] [get_bd_pins Grad6/addra] [get_bd_pins Grad7/addra] \
  [get_bd_pins Grad8/addra]
connect_bd_net [get_bd_pins HOG_Timing_0/RT5_ADDR0] [get_bd_pins Grad0/addrb]
connect_bd_net [get_bd_pins HOG_Timing_0/RT5_ADDR1] [get_bd_pins Grad1/addrb]
connect_bd_net [get_bd_pins HOG_Timing_0/RT5_ADDR2] [get_bd_pins Grad2/addrb]
connect_bd_net [get_bd_pins HOG_Timing_0/RT5_ADDR3] [get_bd_pins Grad3/addrb]
connect_bd_net [get_bd_pins HOG_Timing_0/RT5_ADDR4] [get_bd_pins Grad4/addrb]
connect_bd_net [get_bd_pins HOG_Timing_0/RT5_ADDR5] [get_bd_pins Grad5/addrb]
connect_bd_net [get_bd_pins HOG_Timing_0/RT5_ADDR6] [get_bd_pins Grad6/addrb]
connect_bd_net [get_bd_pins HOG_Timing_0/RT5_ADDR7] [get_bd_pins Grad7/addrb]
connect_bd_net [get_bd_pins HOG_Timing_0/RT5_ADDR8] [get_bd_pins Grad8/addrb]
connect_bd_net [get_bd_pins HOG_Timing_0/RT5_RESTART_V] [get_bd_pins RESTART_V]
connect_bd_net [get_bd_pins HOG_Timing_0/RT5_RESTART_H] [get_bd_pins RESTART_H]
connect_bd_net [get_bd_pins HOG_Timing_0/RT1_SEL] [get_bd_pins CamBuffer/SEL]
connect_bd_net [get_bd_pins CalcGradMag/atan2_table_address0] [get_bd_pins atan2_table/addra]
connect_bd_net -net atan2_table_q0_1 [get_bd_pins atan2_table/douta] [get_bd_pins CalcGradMag/atan2_table_q0]
connect_bd_net -net ap_rst_1 [get_bd_pins util_vector_logic_0/Res] [get_bd_pins CalcGradMag/ap_rst]
